# EAGLE design PowerSupply_12V_v2 (EAGLE 9.6.2)

## Sheet 1 of 3: MAIN
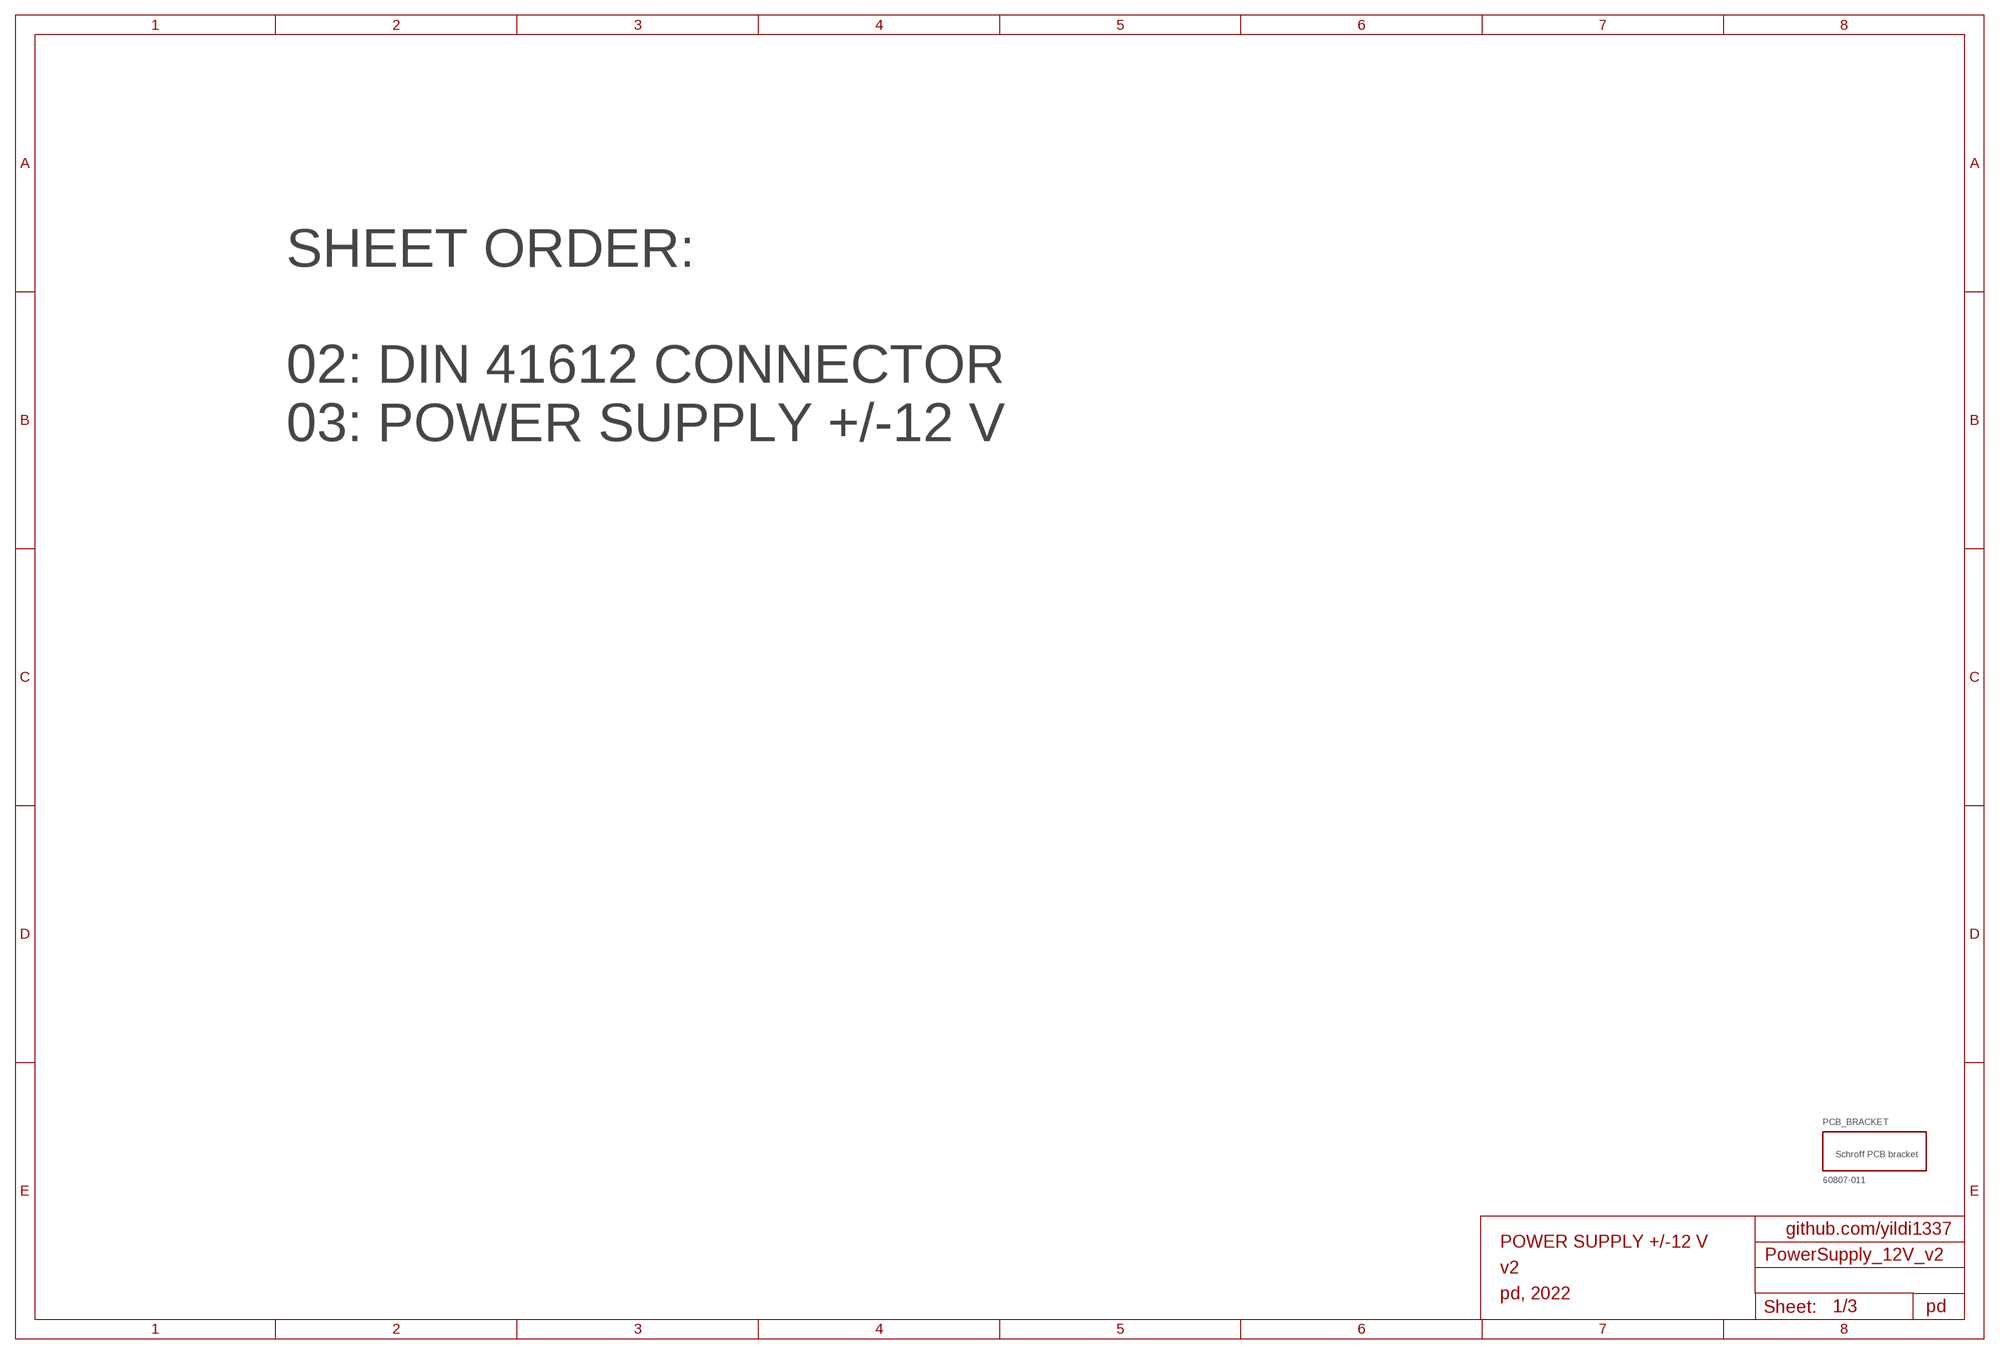
[diagram p0: schematic, sheet 1]

### Parts
PCB_BRACKET  60807-011  [60807-011]

### Notes on the sheet
- SHEET ORDER:
  
  02: DIN 41612 CONNECTOR
  03: POWER SUPPLY +/-12 V
- github.com/yildi1337
- POWER SUPPLY +/-12 V
- v2
- pd, 2022
- pd

## Sheet 2 of 3: DIN 41612 CONNECTOR
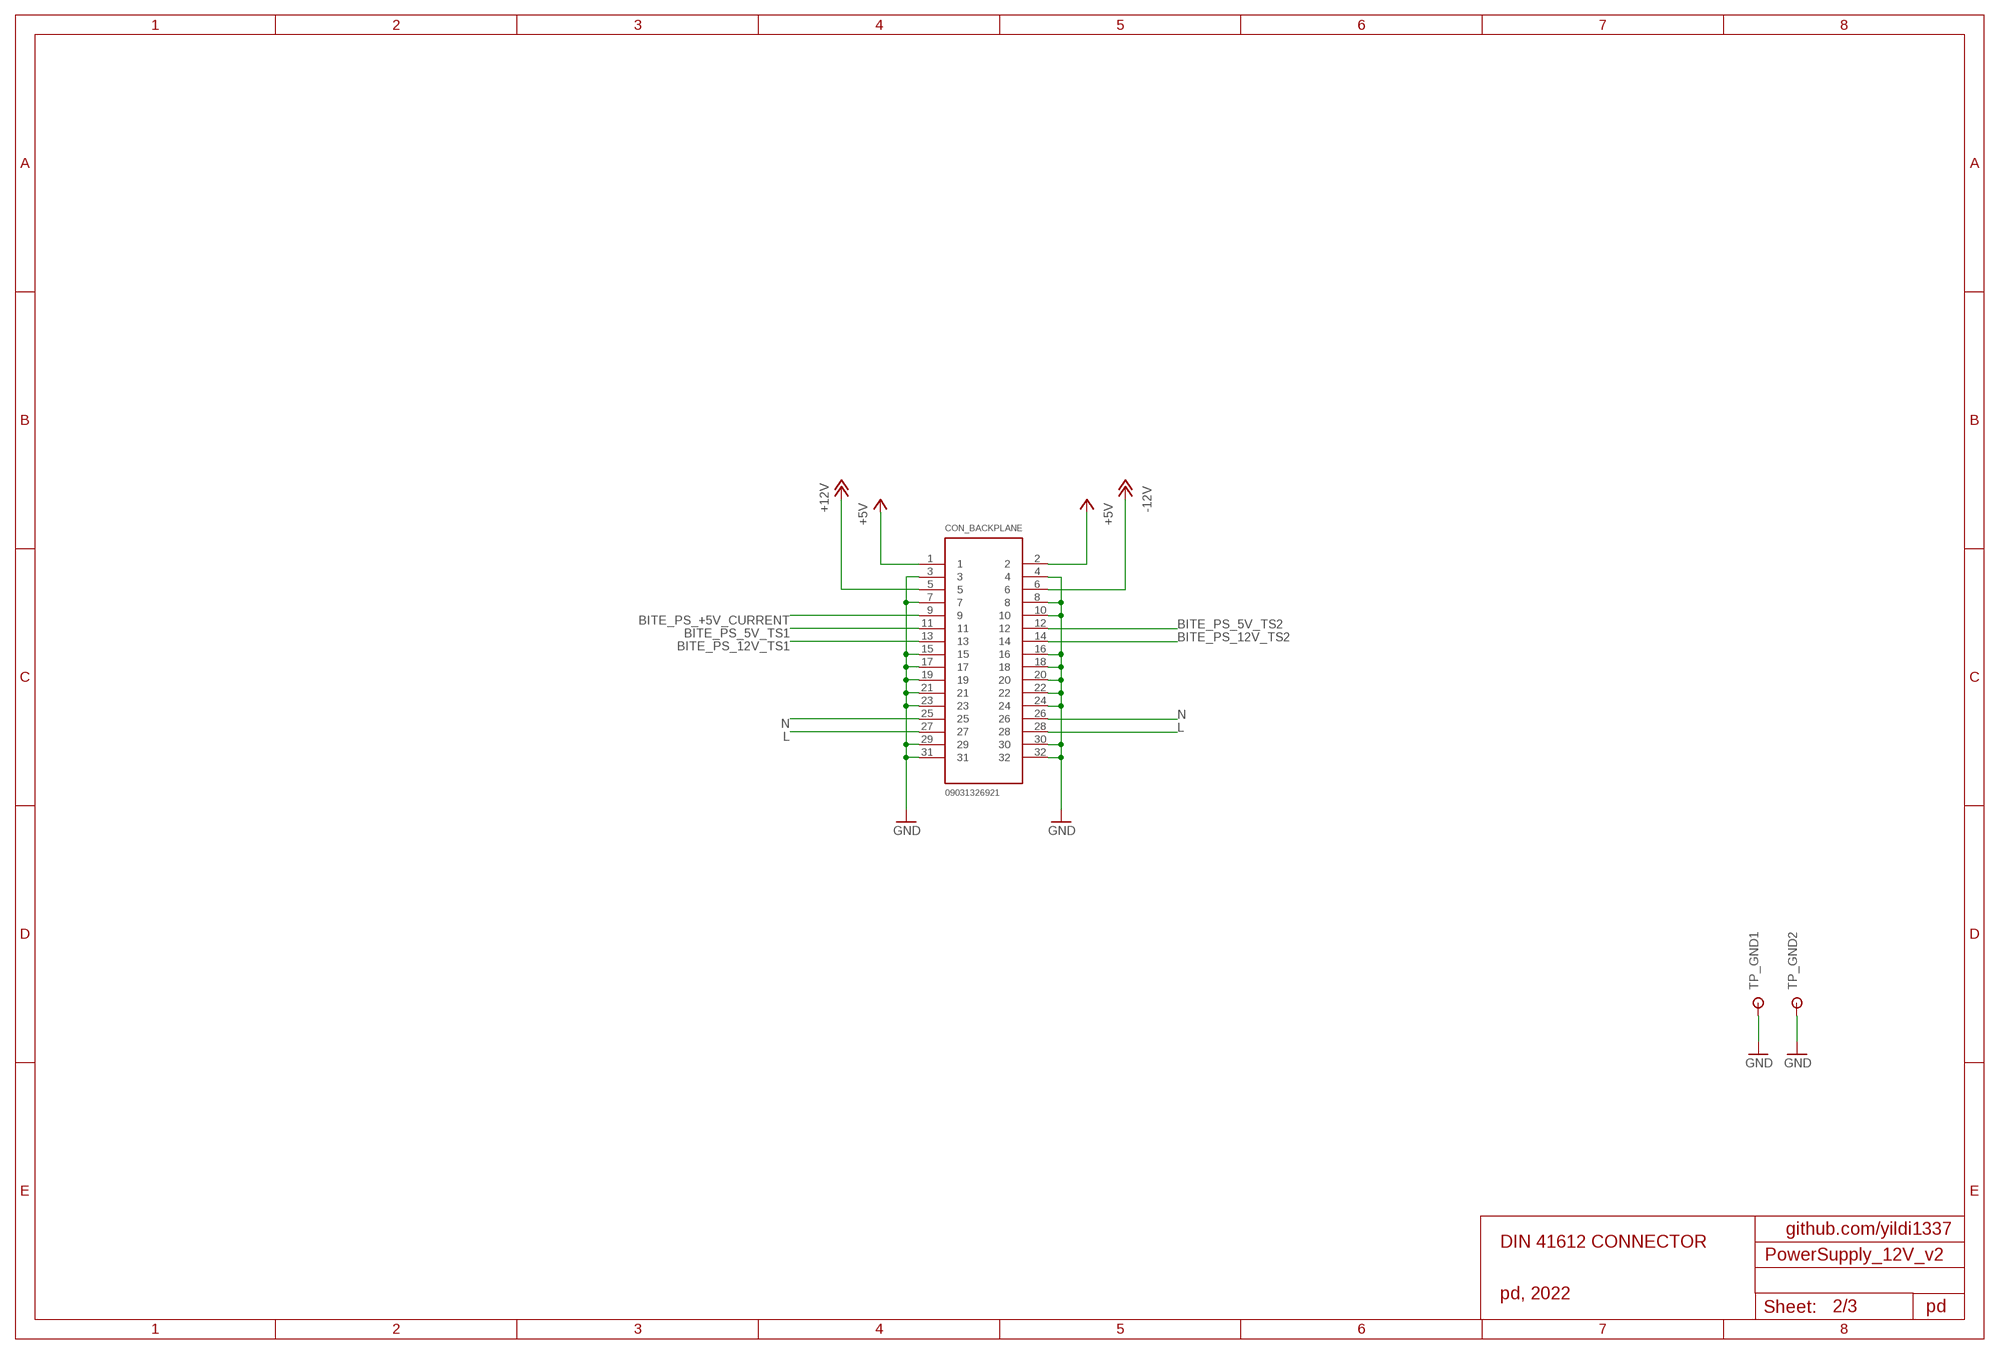
[diagram p1: schematic, sheet 2]

### Parts
CON_BACKPLANE  09031326921  [09031326921]
TP_GND1  RSPRO-1MM-TERMINAL-POST-2622034  [RSPRO-1MM-TERMINAL-POST-2622034]
TP_GND2  RSPRO-1MM-TERMINAL-POST-2622034  [RSPRO-1MM-TERMINAL-POST-2622034]

### Nets
+5V: CON_BACKPLANE.1 CON_BACKPLANE.2
+12V: CON_BACKPLANE.5 ; also sheet 3
-12V: CON_BACKPLANE.6 ; also sheet 3
BITE_PS_5V_TS1: CON_BACKPLANE.11
BITE_PS_5V_TS2: CON_BACKPLANE.12
BITE_PS_12V_TS1: CON_BACKPLANE.13
BITE_PS_12V_TS2: CON_BACKPLANE.14
BITE_PS_+5V_CURRENT: CON_BACKPLANE.9
GND: CON_BACKPLANE.3 CON_BACKPLANE.4 CON_BACKPLANE.7 CON_BACKPLANE.8 CON_BACKPLANE.10 CON_BACKPLANE.15 CON_BACKPLANE.16 CON_BACKPLANE.17 CON_BACKPLANE.18 CON_BACKPLANE.19 CON_BACKPLANE.20 CON_BACKPLANE.21 CON_BACKPLANE.22 CON_BACKPLANE.23 CON_BACKPLANE.24 CON_BACKPLANE.29 CON_BACKPLANE.30 CON_BACKPLANE.31 CON_BACKPLANE.32 TP_GND1.P$1 TP_GND2.P$1 ; also sheet 3
L: CON_BACKPLANE.27 CON_BACKPLANE.28 ; also sheet 3
N: CON_BACKPLANE.25 CON_BACKPLANE.26 ; also sheet 3

### Notes on the sheet
- github.com/yildi1337
- DIN 41612 CONNECTOR
- pd, 2022
- pd

## Sheet 3 of 3: POWER SUPPLY +/-12 V
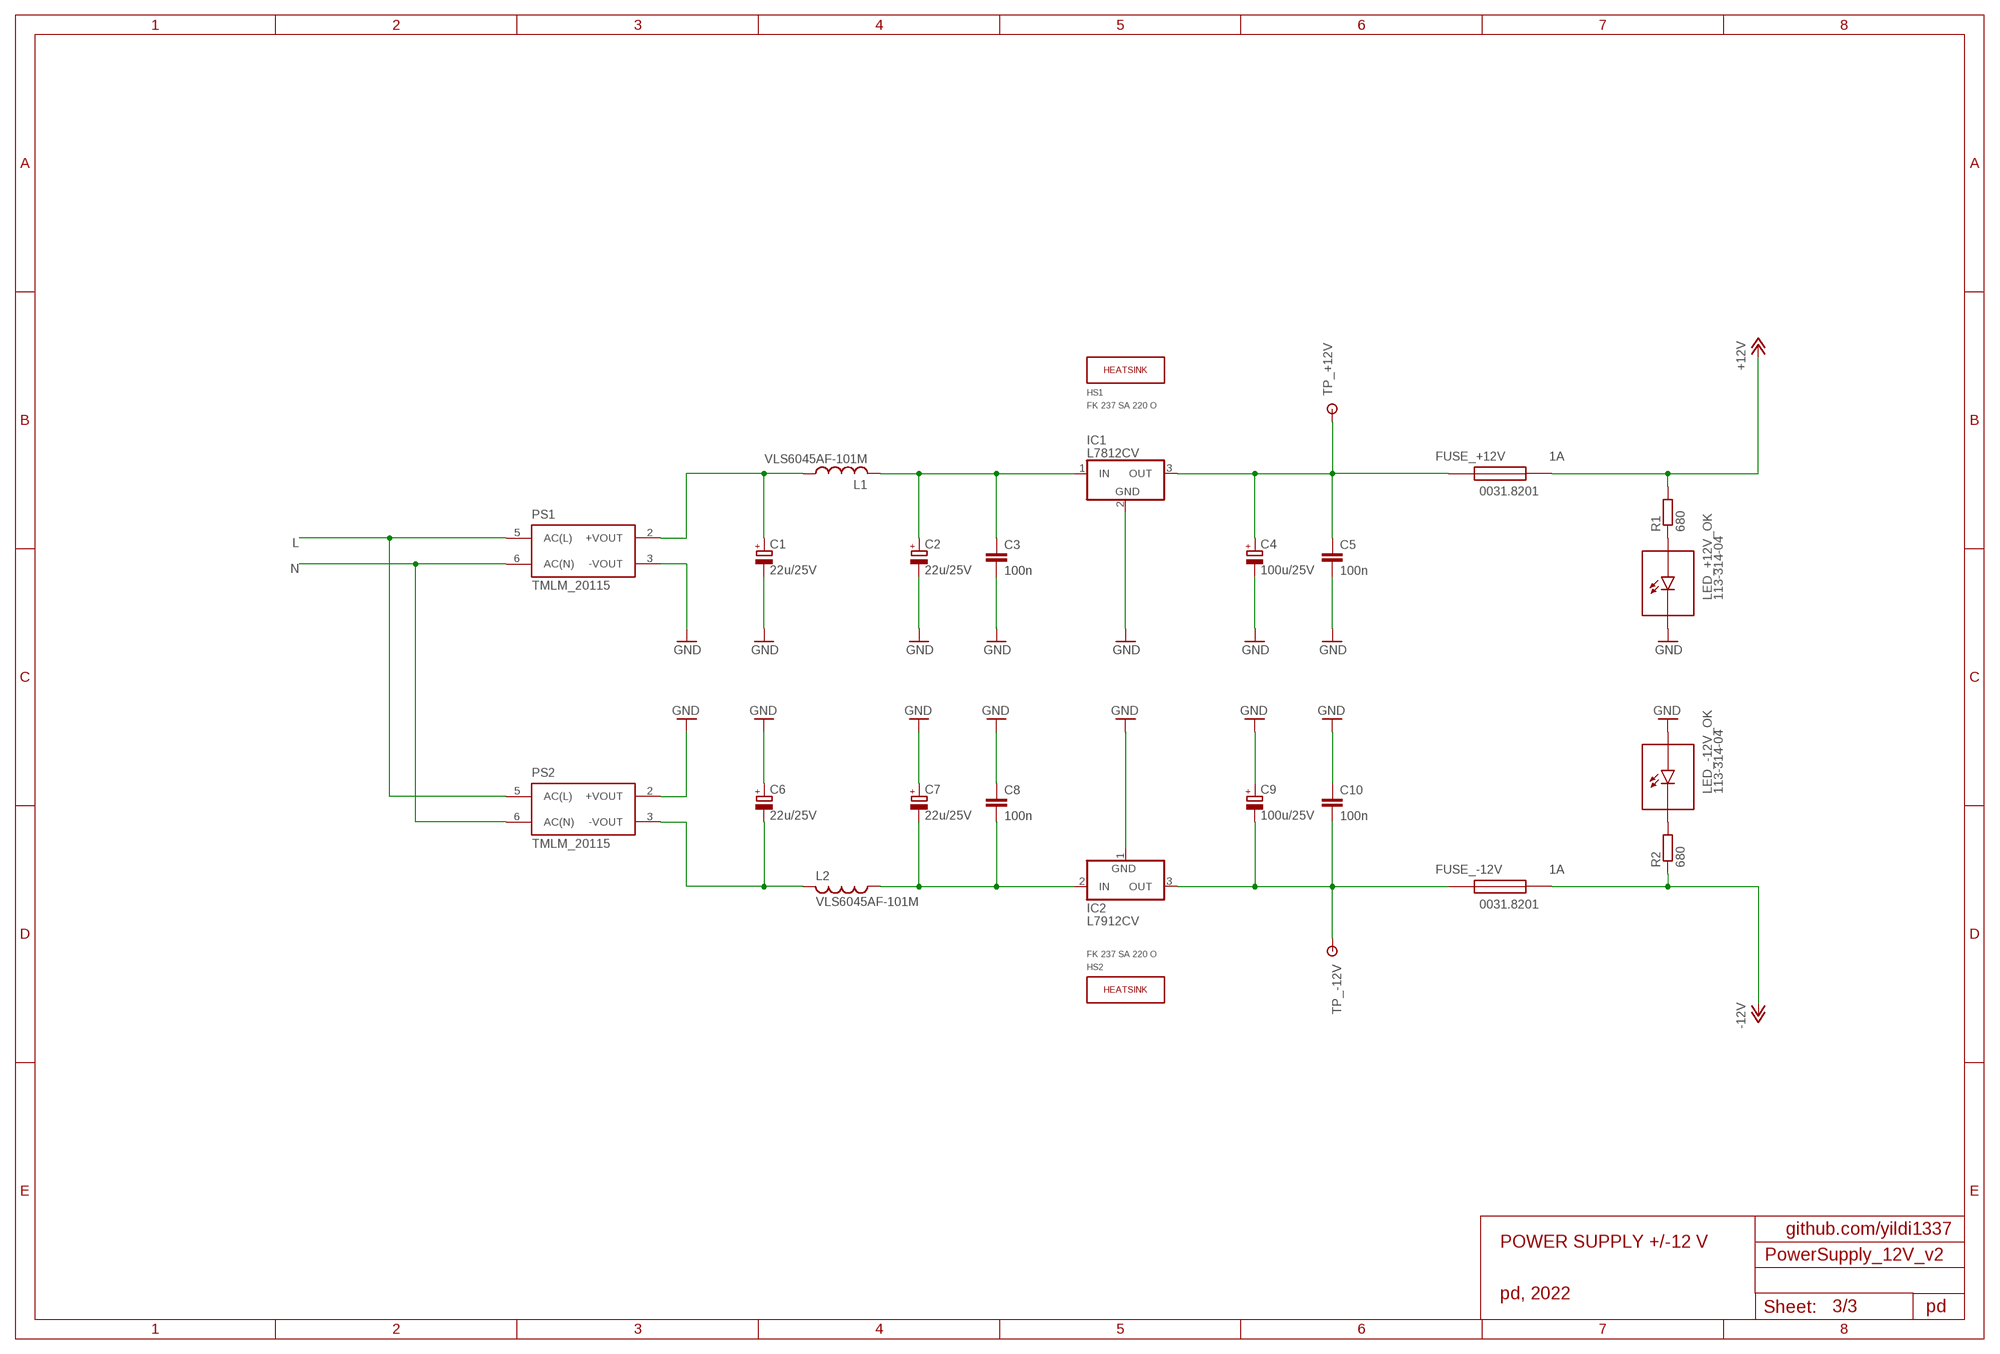
[diagram p2: schematic, sheet 3]

### Parts
C1  22u/25V  CPOL-EU153CLV-0505  [153CLV-0505]
C2  22u/25V  CPOL-EU153CLV-0505  [153CLV-0505]
C3  100n  C-EUC0603  [C0603]
C4  100u/25V  CPOL-EU153CLV-0810  [153CLV-0810]
C5  100n  C-EUC0603  [C0603]
C6  22u/25V  CPOL-EU153CLV-0505  [153CLV-0505]
C7  22u/25V  CPOL-EU153CLV-0505  [153CLV-0505]
C8  100n  C-EUC0603  [C0603]
C9  100u/25V  CPOL-EU153CLV-0810  [153CLV-0810]
C10  100n  C-EUC0603  [C0603]
FUSE_+12V  0031.8201  [0031.8201]
FUSE_-12V  0031.8201  [0031.8201]
HS1  FK 237 SA 220 O  FK_237_SA_220_O  [FK_237_SA_220_O]
HS2  FK 237 SA 220 O  FK_237_SA_220_O  [FK_237_SA_220_O]
IC1  L7812CV  [L7812CV]
IC2  L7912CV  [L7912CV]
L1  VLS6045AF-101M  [VLS6045AF-101M]
L2  VLS6045AF-101M  [VLS6045AF-101M]
LED_+12V_OK  113-314-04  [113-314-04]
LED_-12V_OK  113-314-04  [113-314-04]
PS1  TMLM_20115  TMLM_201XX  [TMLM_201XX]
PS2  TMLM_20115  TMLM_201XX  [TMLM_201XX]
R1  680  R-EU_R0603  [R0603]
R2  680  R-EU_R0603  [R0603]
TP_+12V  RSPRO-1MM-TERMINAL-POST-2622034  [RSPRO-1MM-TERMINAL-POST-2622034]
TP_-12V  RSPRO-1MM-TERMINAL-POST-2622034  [RSPRO-1MM-TERMINAL-POST-2622034]

### Nets
+12V: FUSE_+12V.2 R1.2 ; also sheet 2
-12V: FUSE_-12V.2 R2.1 ; also sheet 2
GND: C1.- C2.- C3.2 C4.- C5.2 C6.+ C7.+ C8.1 C9.+ C10.1 IC1.2(GND) IC2.1(GND) LED_+12V_OK.-(C) LED_-12V_OK.+(A) PS1.3(-VOUT) PS2.2(+VOUT) ; also sheet 2
L: PS1.5(AC(L)) PS2.5(AC(L)) ; also sheet 2
N: PS1.6(AC(N)) PS2.6(AC(N)) ; also sheet 2
N$1: C7.- C8.2 IC2.2(IN) L2.1
N$2: LED_-12V_OK.-(C) R2.2
N$3: C9.- C10.2 FUSE_-12V.1 IC2.3(OUT) TP_-12V.P$1
N$4: C1.+ L1.1 PS1.2(+VOUT)
N$5: C6.- L2.2 PS2.3(-VOUT)
N$7: LED_+12V_OK.+(A) R1.1
N$8: C4.+ C5.1 FUSE_+12V.1 IC1.3(OUT) TP_+12V.P$1
N$12: C2.+ C3.1 IC1.1(IN) L1.2

### Notes on the sheet
- 1A
- 1A
- github.com/yildi1337
- POWER SUPPLY +/-12 V
- pd, 2022
- pd

## Library data of the parts
C1 C2 C4 C6 C7 C9 = rcl:CPOL-EU: POLARIZED CAPACITOR, European symbol; SPICEPREFIX: C
C3 C5 C8 C10 = rcl:C-EU: CAPACITOR, European symbol; SPICEPREFIX: C
CON_BACKPLANE = 09031326921:09031326921
FUSE_+12V FUSE_-12V = 0031.8201:0031.8201
HS1 HS2 = FK_237_SA_220_O:FK_237_SA_220_O
IC1 = L7812CV:L7812CV
IC2 = L7912CV:L7912CV
L1 L2 = VLS6045AF-101M:VLS6045AF-101M
LED_+12V_OK LED_-12V_OK = 113-314-04:113-314-04
PCB_BRACKET = 60807-011:60807-011
PS1 PS2 = TMLM_201XX:TMLM_201XX
R1 R2 = rcl:R-EU_: RESISTOR, European symbol; SPICEPREFIX: R
TP_+12V TP_-12V TP_GND1 TP_GND2 = RSPRO-1MM-TERMINAL-POST-2622034:RSPRO-1MM-TERMINAL-POST-2622034

## Board
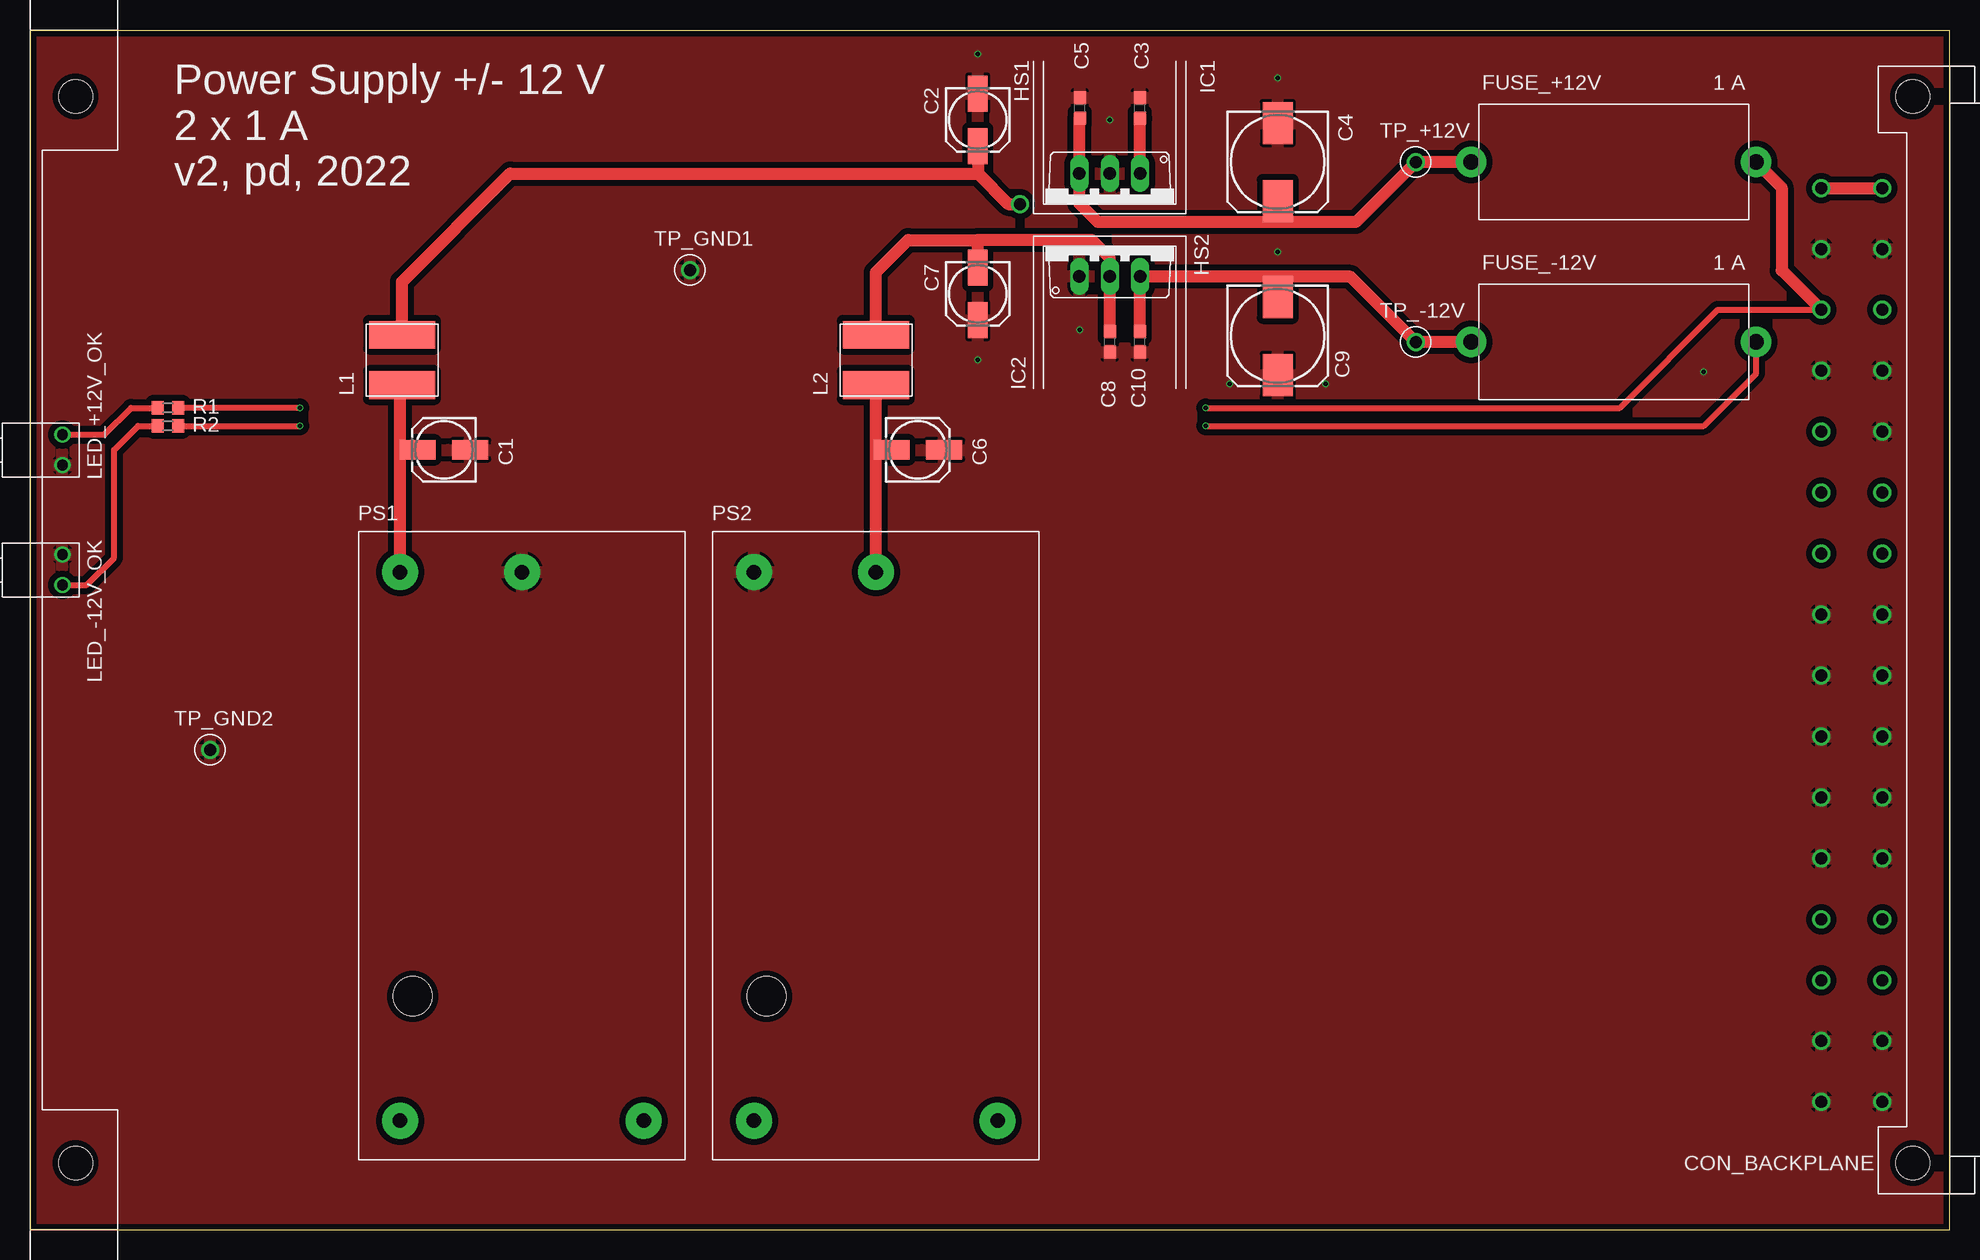
[diagram p3: board, top side]
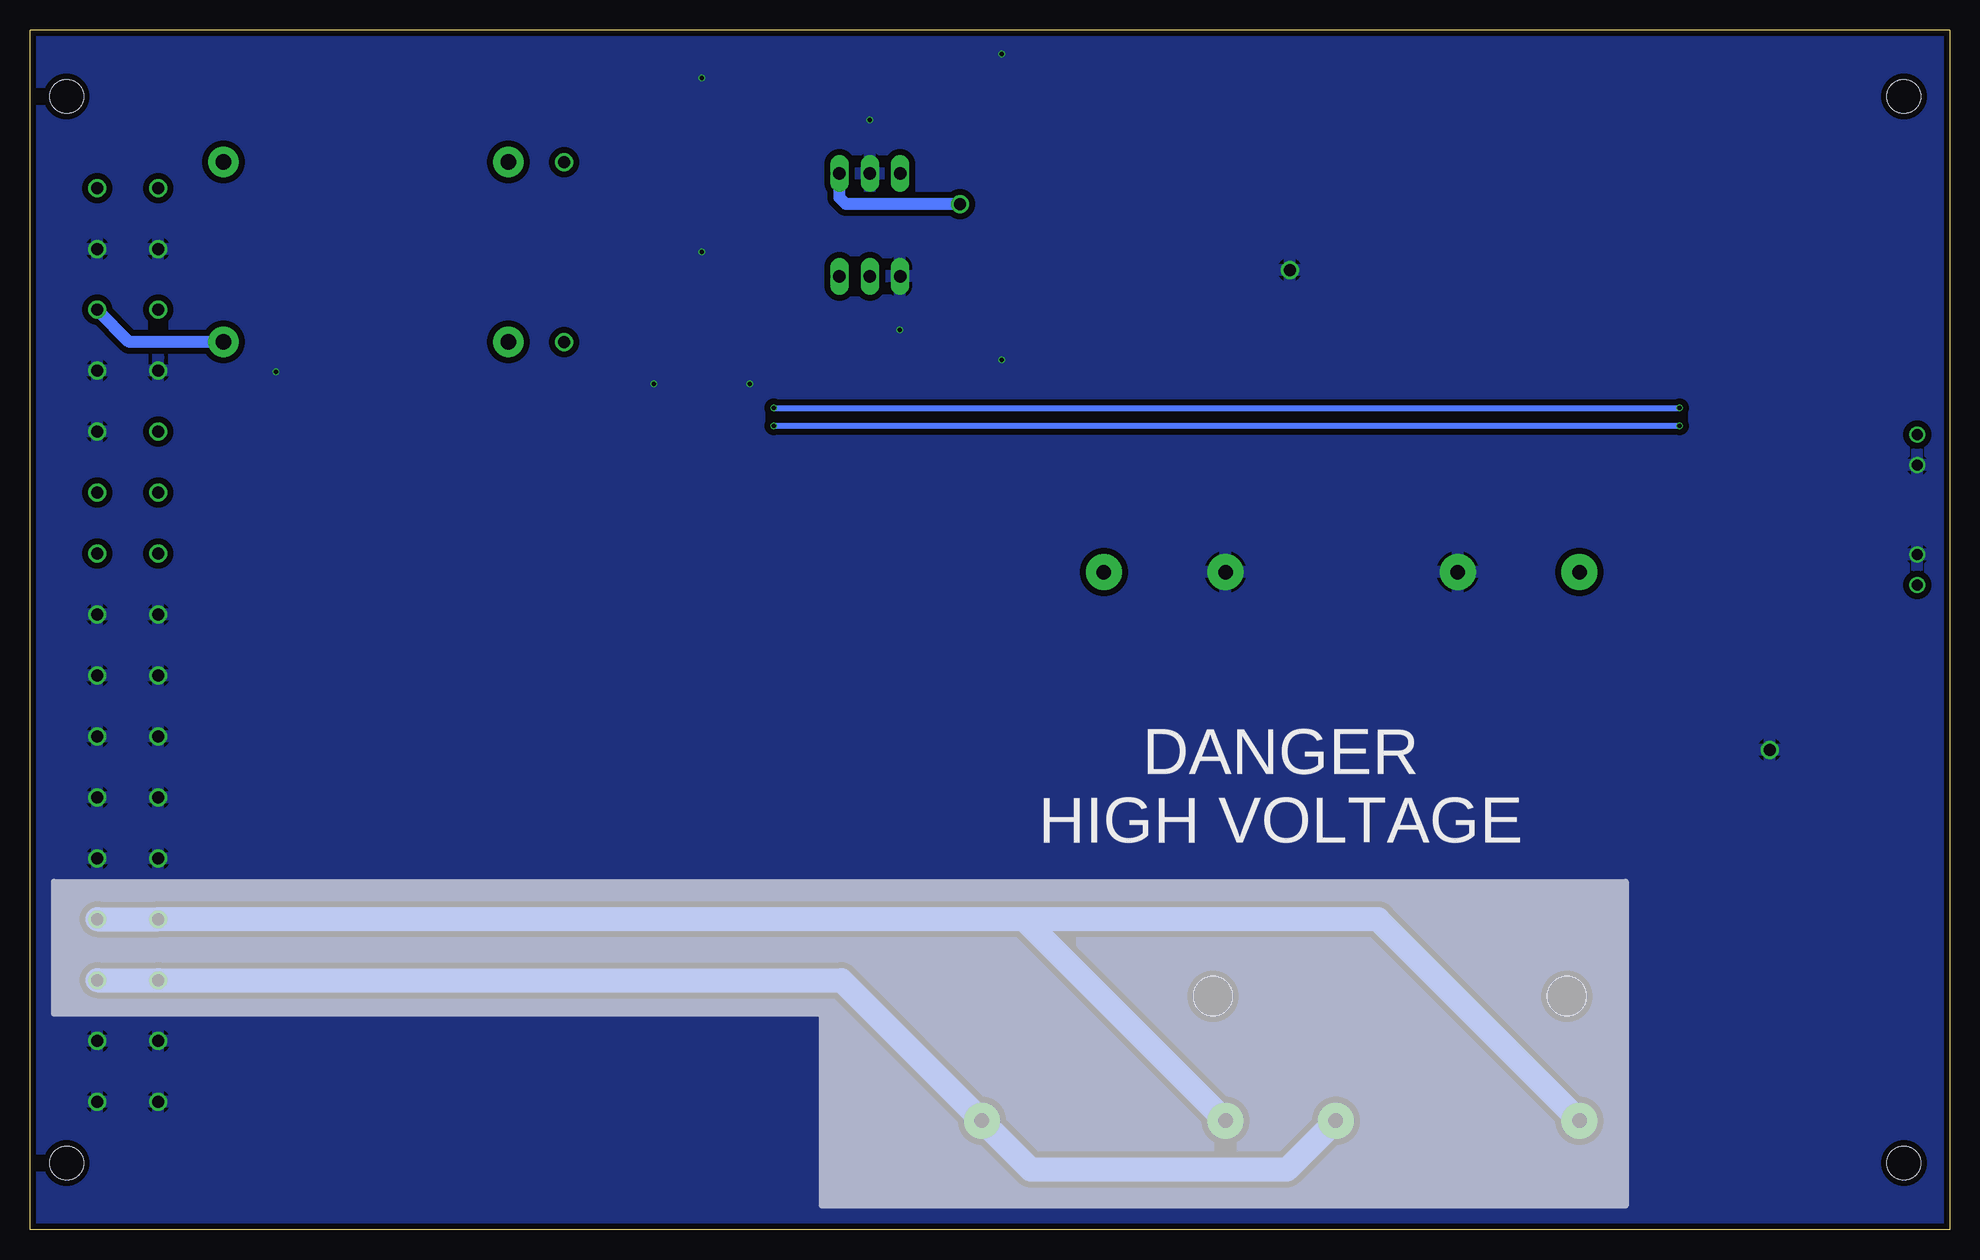
[diagram p4: board, bottom side, seen from below]

Size 160 x 100 mm. Coordinates in mm from the lower left corner, seen from the top.
Outline: 0,0 160,0 160,100 0,100 0,0
Copper layers (1*16): Top 0.035559375mm / dielectric 1.6mm / Bottom 0.035559375mm
Design rules "jlcpcb2layer": minimum track width 5mil, minimum drill 12mil, track to track 5mil, track to pad 5mil, pad to pad 5mil, via to via 5mil, smd to smd 5mil, copper to edge 8mil, drill to drill 6mil, minimum pad ring 5mil, minimum via ring 3mil, stop-mask expansion 2.5mil, vias tented up to drill 0mil, thermal gap 10mil

### Footprints (pad centres in the part's own frame; a part is rotated, then mirrored left to right if it is on the bottom)
153CLV-0505 = smd 3 x 1.6: + 2.2,0; - -2.2,0
C0603 = smd 1.1 x 1: 1 -0.85,0; 2 0.85,0
153CLV-0810 = smd 3.5 x 2.5: + 3.25,0; - -3.25,0
09031326921 = drill 1: 1 36.83,10.7; 2 36.83,5.62; 3 31.75,10.7; 4 31.75,5.62; 5 26.67,10.7; 6 26.67,5.62; 7 21.59,10.7; 8 21.59,5.62; 9 16.51,10.7; 10 16.51,5.62; 11 11.43,10.7; 12 11.43,5.62; 13 6.35,10.7; 14 6.35,5.62; 15 1.27,10.7; 16 1.27,5.62; 17 -3.81,10.7; 18 -3.81,5.62; 19 -8.89,10.7; 20 -8.89,5.62; 21 -13.97,10.7; 22 -13.97,5.62; 23 -19.05,10.7; 24 -19.05,5.62; 25 -24.13,10.7; 26 -24.13,5.62; 27 -29.21,10.7; 28 -29.21,5.62; 29 -34.29,10.7; 30 -34.29,5.62; 31 -39.37,10.7; 32 -39.37,5.62 | hole 2.8: -44.45,3.05; 44.45,3.05
0031.8201 = drill 1.3 pad 2.54: 1 -11.875,0; 2 11.875,0
L7812CV = drill 1.016 long: 1 -2.54,-2.54; 2 0,-2.54; 3 2.54,-2.54
L7912CV = drill 1.016 long: 1 -2.54,-2.54; 2 0,-2.54; 3 2.54,-2.54
VLS6045AF-101M = smd 2.3 x 5.5: 1 -2.1,0; 2 2.1,0
113-314-04 = drill 0.9: + -1.27,0; - 1.27,0
60807-011 = hole 2.8: 0,44.45; 0,-44.45
TMLM_201XX = drill 1.2 pad 3: 2 -10.16,22.8; 3 0,22.8; 5 10.16,-22.92; 6 -10.16,-22.92 | hole 3.25: -9.1,-12.55
R0603 = smd 1 x 1.1: 1 -0.85,0; 2 0.85,0
RSPRO-1MM-TERMINAL-POST-2622034 = drill 1: P$1 0,0

### Placement (x,y rotation side)
C1  34.5,65 180 top
C2  79,92.5 270 top
C3  92.5,93.5 90 top
C4  104,89 270 top
C5  87.5,93.5 90 top
C6  74,65 0 top
C7  79,78 270 top
C8  90,74 90 top
C9  104,74.5 270 top
C10  92.5,74 90 top
CON_BACKPLANE  160,50 90 top
FUSE_+12V  132,89 0 top
FUSE_-12V  132,74 0 top
HS1  90,85.5 180 top
HS2  90,82 0 top
IC1  90,85.5 180 top
IC2  90,82 0 top
L1  31,72.5 90 top
L2  70.5,72.5 270 top
LED_+12V_OK  2.7,65 270 top
LED_-12V_OK  2.7,55 270 top
PCB_BRACKET  3.8,50 0 top
PS1  41,32 0 top
PS2  70.5,32 0 top
R1  11.5,68.5 0 top
R2  11.5,67 180 top
TP_+12V  115.5,89 0 top
TP_-12V  115.5,74 0 top
TP_GND1  55,80 0 top
TP_GND2  15,40 0 top

### Tracks (layer width: path | path; a pad name or v marks a point on that pad's centre or on a via)
+5V
  Top 1: CON_BACKPLANE.1 CON_BACKPLANE.2
+12V  (via drill 0.35)
  Top 0.5: v22.5,68.5 R1.2 | v98,68.5 132.5,68.5 140.67,76.67 CON_BACKPLANE.5
  Top 1: FUSE_+12V.2 146,86.88 146,79.97 CON_BACKPLANE.5
  Bottom 0.5: v98,68.5 v22.5,68.5
-12V  (via drill 0.35)
  Top 0.5: R2.1 v22.5,67 | v98,67 139.5,67 143.88,71.38 FUSE_-12V.2
  Bottom 0.5: v22.5,67 v98,67
  Bottom 1: FUSE_-12V.2 151.71,74 CON_BACKPLANE.6
GND  (via drill 0.35)
  other vias: 79,98 79,72.5 90,92.5 108,70.5 87.5,75 104,81.5 104,96 100,70.5 139.5,71.5
  pour Bottom (isolate 0.5): 0,0 0,100 160,100 160,0
  pour Top (isolate 0.5): 0,0 0,100 160,100 160,0
L
  Bottom 2: CON_BACKPLANE.28 CON_BACKPLANE.27 92.37,20.79 PS2.5 76.58,5 55.24,5 PS1.5
N
  Bottom 2: CON_BACKPLANE.26 CON_BACKPLANE.25 77.5,25.87 77.13,25.87 | PS1.6 47.63,25.87 77.13,25.87 | PS2.6 77.13,25.87
N$1
  Top 1: 79,82.5 73.2,82.5 70.5,79.8 L2.1 | C7.- 79,82.5 | C8.2 IC2.2 90,81 88.5,82.5 79,82.5
N$2
  Top 0.5: LED_-12V_OK.- 4.73,53.73 7,56 7,65 9,67 R2.2
N$3
  Top 1: FUSE_-12V.1 TP_-12V.P$1 110.08,79.42 104,79.42 | C9.- 104,79.42 | 104,79.42 103.96,79.46 IC2.3 92.5,79.42 C10.2
N$4
  Top 1: PS1.2 30.84,65 | 30.84,65 30.84,70.24 L1.1 | C1.+ 30.84,65
N$5
  Top 1: PS2.3 70.5,65 | 70.5,65 L2.2 | C6.- 70.5,65
N$7
  Top 0.5: LED_+12V_OK.+ 6.2,66.27 8.43,68.5 R1.1
N$8
  Top 1: FUSE_+12V.1 TP_+12V.P$1 110.5,84 104,84 | C4.+ 104,84 | C5.1 87.46,92.61 IC1.3 87.46,85.54 89,84 104,84
N$12  (via drill 1)
  Top 1: C2.+ 79,88.04 | 79,88.04 40.04,88.04 31,79 L1.2 | IC1.1 92.54,92.61 C3.1 | 79,88.04 81.54,85.5 v82.5,85.5
  Bottom 1: v82.5,85.5 92,85.5 92.54,86.04 IC1.1

### Text on the board
tPlace: 1 A | Power Supply +/- 12 V / 2 x 1 A / v2, pd, 2022 | 1 A
bPlace: DANGER / HIGH VOLTAGE